# EAGLE design Adafruit_PCF8591 (EAGLE 9.6.2)
COMPANY: ADAFRUIT INDUSTRIES; DRAWN: KTOWN; REV: A
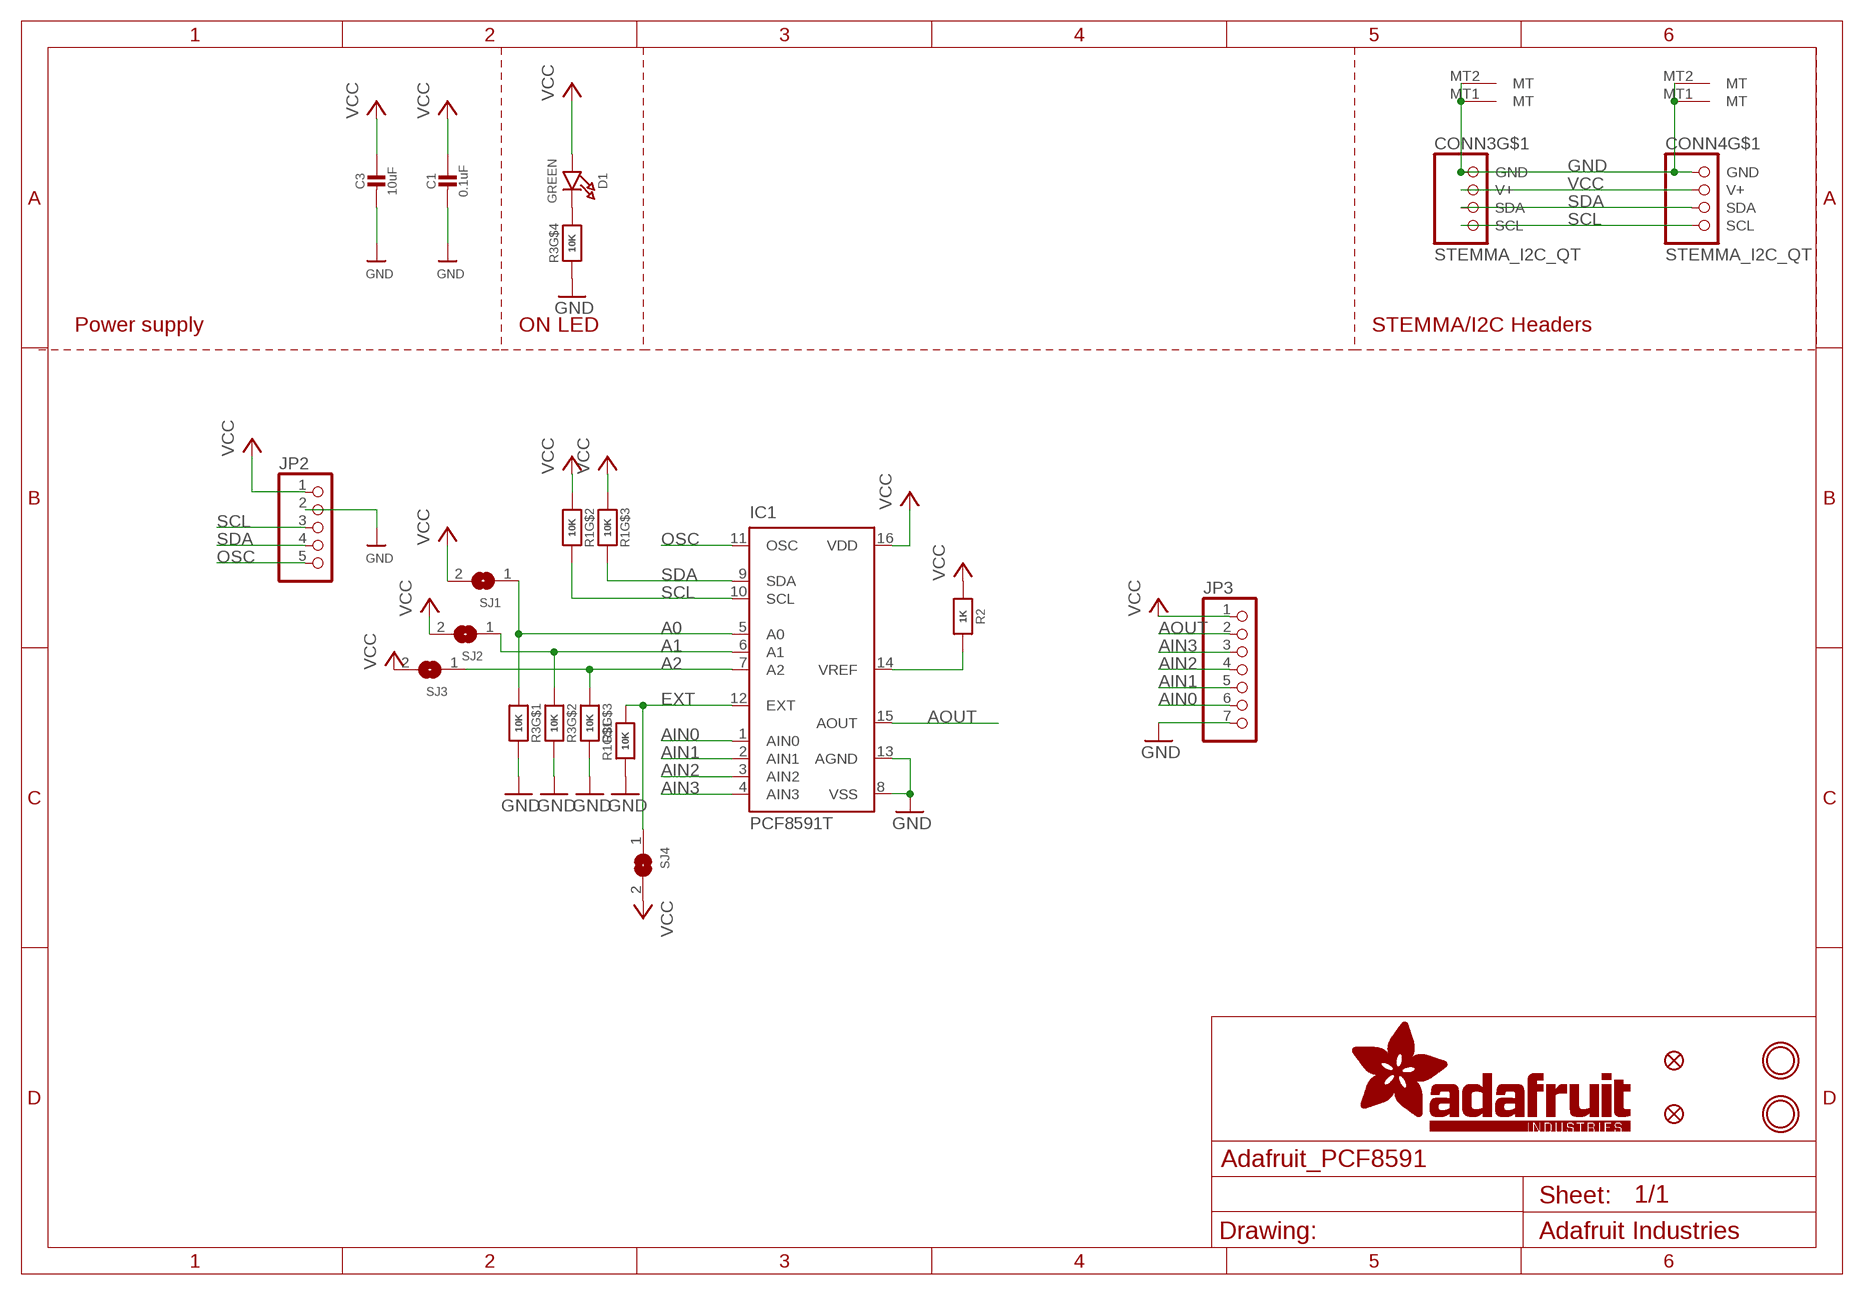
[diagram p0: schematic, sheet 1]

## Parts
C1  0.1uF  CAP_CERAMIC0603_NO  [0603-NO]
C3  10uF  CAP_CERAMIC0805-NOOUTLINE  [0805-NO]
CONN3  STEMMA_I2C_QT  [JST_SH4]
CONN4  STEMMA_I2C_QT  [JST_SH4]
D1  GREEN  LED0603_NOOUTLINE  [CHIPLED_0603_NOOUTLINE]
FID3  FIDUCIAL_1MM  [FIDUCIAL_1MM]
FID4  FIDUCIAL_1MM  [FIDUCIAL_1MM]
IC1  PCF8591T  [SO16W]
JP2  HEADER-1X570MIL  [1X05_ROUND_70]
JP3  HEADER-1X770MIL  [1X07_ROUND_70]
R1  10K  RESISTOR_4PACK  [RESPACK_4X0603]
R2  1K  RESISTOR_0603_NOOUT  [0603-NO]
R3  10K  RESISTOR_4PACK  [RESPACK_4X0603]
SJ1  SOLDERJUMPER  [SOLDERJUMPER_ARROW_NOPASTE]
SJ2  SOLDERJUMPER  [SOLDERJUMPER_ARROW_NOPASTE]
SJ3  SOLDERJUMPER  [SOLDERJUMPER_ARROW_NOPASTE]
SJ4  SOLDERJUMPER  [SOLDERJUMPER_ARROW_NOPASTE]
U$19  MOUNTINGHOLE2.5  [MOUNTINGHOLE_2.5_PLATED]
U$21  MOUNTINGHOLE2.5  [MOUNTINGHOLE_2.5_PLATED]

## Nets
A0: IC1.5(A0) R3.1 SJ1.1
A1: IC1.6(A1) R3.2 SJ2.1
A2: IC1.7(A2) R3.3 SJ3.1
AIN0: IC1.1(AIN0) JP3.6
AIN1: IC1.2(AIN1) JP3.5
AIN2: IC1.3(AIN2) JP3.4
AIN3: IC1.4(AIN3) JP3.3
AOUT: IC1.15(AOUT) JP3.2
EXT: IC1.12(EXT) R1.8 SJ4.1
GND [highpower]: C1.2 C3.2 CONN3.1(GND) CONN3.MT1(MT) CONN3.MT2(MT) CONN4.1(GND) CONN4.MT1(MT) CONN4.MT2(MT) IC1.8(VSS) IC1.13(AGND) JP2.2 JP3.7 R1.1 R3.4 R3.6 R3.7 R3.8
N$1: D1.C R3.5
N$4: IC1.14(VREF) R2.2
OSC: IC1.11(OSC) JP2.5
SCL: CONN3.4(SCL) CONN4.4(SCL) IC1.10(SCL) JP2.3 R1.7
SDA: CONN3.3(SDA) CONN4.3(SDA) IC1.9(SDA) JP2.4 R1.6
VCC [highpower]: C1.1 C3.1 CONN3.2(V+) CONN4.2(V+) D1.A IC1.16(VDD) JP2.1 JP3.1 R1.2 R1.3 R2.1 SJ1.2 SJ2.2 SJ3.2 SJ4.2
Unconnected: R1.4 R1.5

## Notes on the sheet
- Power supply | ON LED | STEMMA/I2C Headers

## Library data of the parts
C1 C3 = microbuilder:CAP_CERAMIC: Ceramic Capacitors For new designs, use the packages preceded by an '_' character since they are more reliable: The following footprints should be used on most boards: _0402 - Standard footprint for regular board layouts _0603 - Standard footprint for regular board layouts _0805 - Standard footprint for regular board layouts _1206 - Standard footprint for regular board layouts For extremely tight-pitch boards where space is at a premium, the following 'micro-pitch' footprints can be used (smaller pads, no silkscreen outline, etc.): _0402MP - Micro-pitch footprint for very dense/compact boards _0603MP - Micro-pitch footprint for very dense/compact boards _0805MP - Micro-pitch footprint for very dense/compact boards _1206MP - Micro-pitch footprint for very dense/compact boards
CONN3 CONN4 = microbuilder:STEMMA_I2C
D1 = microbuilder:LED: LED 0603 - 0603 Surface Mount Package 2mA: Green LED - Low Power (3.9mcd, 2ma, 1.7Vf) - Digikey: 475-2709-2-ND Orange LED - Low Power (9.8mcd, 2ma, 1.8Vf) - Digikey: 475-1194-2-ND Red LED - Low Power (5mcd, 2ma, 1.8Vf) - Digikey: 475-1195-2-ND Yellow LED - Low Power (7mcd, 2ma, 1.8Vf) - Digikey: 475-1196-2-ND 5mA: Blue LED - Low Power (17mcd, 5ma, 2.9Vf) - Digikey: LNJ937W8CRACT-ND 0805 - 0805 Surface Mount Package 2mA: Red LED (8.8mcd, 2mA, 1.8Vf, Clear) - Low Power [Digikey: 475-2510-1-ND] Green LED (5mcd, 2mA, 1.8Vf, Clear) - Low Power [Digikey: 475-2730-1-ND] Yellow LED (11.3mcd, 2mA, 1.8Vf, Clear) - Low Power [Digikey: 475-2555-1-ND] 20mA: Red LED (104mcd, 20mA, Diffused) - LS R976 [Digikey: 475-1278-6-ND] Red LED (12mcd, 20mA, 2.0Vf, Clear) - APT2012EC [Digikey: 754-1128-1-ND] Green LED (15mcd, 20mA, 2.2Vf, Clear) - APT2012GC [Digikey: 754-1131-1-ND] Orange LED (160mcd, 20mA, 2.1Vf, Clear) - APT2012SECK [Digikey: 754-1130-1-ND] 1206 - 1206 Surface Mount Package Green LED (26mcd, 20mA, Diffused) - LG N971 [Digikey: 475-1407-6-ND] Red LED (15mcd, 20mA, Diffused) - LH N974 [Digikey: 475-1416-6-ND] Cree - Cree High-Power Surface Mount LEDs XPEBWT-L1-0000-00D50 - White 111lm 350mA 2.9Vf 6200K 110° XTEAWT-00-0000-00000LEE3 - White 114lm 350mA 2.85Vf 5000K 115° Everlight - Everlight 45-21 Series Surface Mount LEDs 45-21/QK2C-B2832AC2CB2/2T - Warm White 2000mcd 20mA 3.25Vf 3050K 120° 45-21/LK2C-B38452C4CB2/2T - Nuetral White 2000mcd 20mA 3.25Vf 4150K 120° 45-21/LK2C-B50634C6CB2/2T - Cold White 2200mcd 20mA 3.25Vf 5650K 120° PLCC2 Reverse Mount LS T77K-J1L2-1-0-2-R18-Z - Red 11.25mcd 2mA 1.8Vf 630nm 120° LO T77K-L1M2-24-Z - Orange 19.6mcd 2mA 1.8Vf 606nm 120° LY T77K-K2M1-26-Z - Yellow 15.7mcd 2mA 1.8Vf 587nm 120°
FID3 FID4 = microbuilder:FIDUCIAL: Fiducial Alignment Points Various fiducial points for machine vision alignment.; BOM: EXCLUDE
IC1 = micro-philips:PCF8591: I2C-Bus D/A CONVERTER; MPN: PCF8591T/2,512; OC_FARNELL: 1826767; OC_NEWARK: 70R6911
JP2 = microbuilder:HEADER-1X5: PIN HEADER
JP3 = microbuilder:HEADER-1X7: PIN HEADER
R1 R3 = microbuilder:RESISTOR_4PACK: Resistor Packs (4 resistors) 4 x 0603 10K 1/16W - Digikey: YC164J-10KCT-ND
R2 = microbuilder:RESISTOR: Resistors For new designs, use the packages preceded by an '_' character since they are more reliable: The following footprints should be used on most boards: _0402 - Standard footprint for regular board layouts _0603 - Standard footprint for regular board layouts _0805 - Standard footprint for regular board layouts _1206 - Standard footprint for regular board layouts For extremely tight-pitch boards where space is at a premium, the following 'micro-pitch' footprints can be used (smaller pads, no silkscreen outline, etc.): _0402MP - Micro-pitch footprint for very dense/compact boards _0603MP - Micro-pitch footprint for very dense/compact boards _0805MP - Micro-pitch footprint for very dense/compact boards _1206MP - Micro-pitch footprint for very dense/compact boards
SJ1-SJ4 = microbuilder:SOLDERJUMPER: SMD Solder JUMPER Solder the two pads together to create a connection, or remove the solder to break it. REFLOW - Use this footprint for solder paste and reflow ovens. WAVE - Use this footprint for hand-soldering (larger pads). CLOSED - Has a trace between the two pads to ensure it is closed by default. The trace needs to be cut to disable the jumper, and can be closed again by creating a solder bridge between the two pads.; BOM: EXCLUDE
U$19 U$21 = microbuilder:MOUNTINGHOLE: Mounting Hole For #2 screws (0.086"/2.18mm width, 0.094"/2.4mm hole) use 2.5mm; BOM: EXCLUDE

## Net classes
1 highpower: width 0.305 mm, drill 0.483 mm
2 lowpower: width 0.254 mm, drill 0.483 mm

## Board
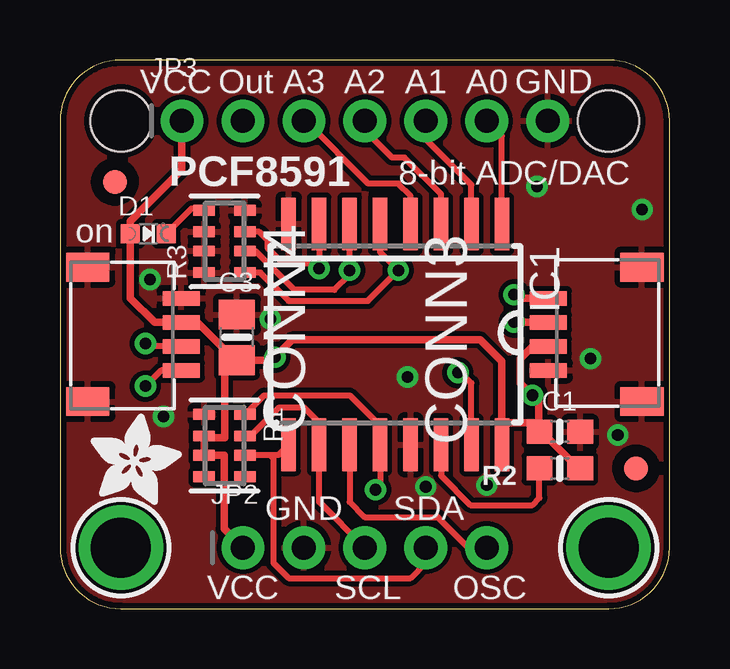
[diagram p1: board, top side]
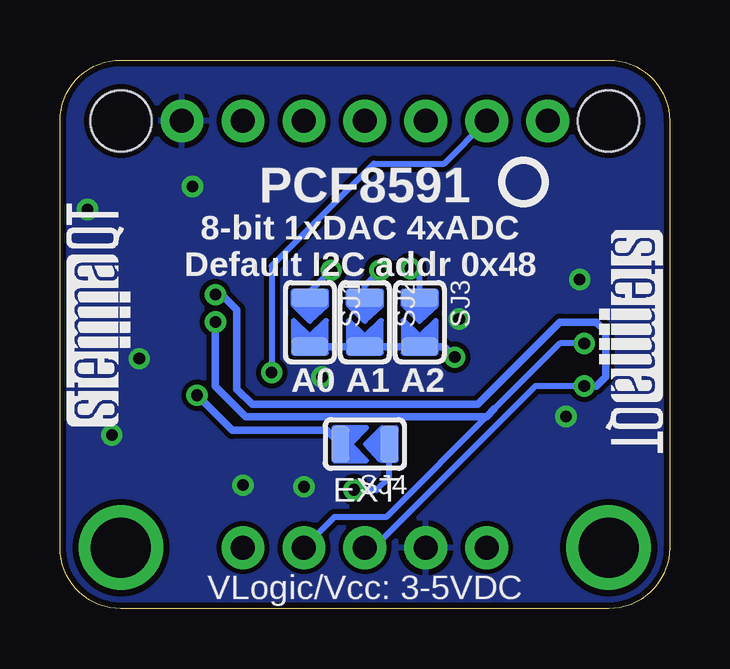
[diagram p2: board, bottom side, seen from below]

Size 25.4 x 22.86 mm. Coordinates in mm from the lower left corner, seen from the top.
Outline: 0,20.32 0,2.54 arc90 2.54,0 22.86,0 arc90 25.4,2.54 25.4,20.32 arc90 22.86,22.86 2.54,22.86 arc90 0,20.32
Copper layers (1*16): Top 0.035mm / dielectric 1.5mm / Bottom 0.035mm
Design rules "adafruit *": minimum track width 8mil, minimum drill 15.5mil, track to track 8mil, track to pad 8mil, pad to pad 8mil, via to via 8mil, smd to smd 8mil, copper to edge 10mil, drill to drill 8mil, minimum pad ring 10mil, minimum via ring 8mil, stop-mask expansion 2mil, vias tented up to drill 20mil, thermal gap 10mil
Holes 2.54 mm at 2.54,20.32 22.86,20.32

### Footprints (pad centres in the part's own frame; a part is rotated, then mirrored left to right if it is on the bottom)
0603-NO = smd 1.075 x 1: 1 -0.85,0; 2 0.85,0
0805-NO = smd 1.24 x 1.5: 1 -0.95,0; 2 0.95,0
JST_SH4 = smd 0.6 x 1.55: 1 -1.5,2.514; 2 -0.5,2.514; 3 0.5,2.514; 4 1.5,2.514 | smd 1.2 x 1.8: MT1 -2.8,-1.386; MT2 2.8,-1.386
CHIPLED_0603_NOOUTLINE = smd 0.8 x 0.8: A 0,-0.75; C 0,0.75
FIDUCIAL_1MM = smd 1 x 1: 1 0,0
SO16W = smd 0.6 x 2.2: 1 -4.445,-4.6; 2 -3.175,-4.6; 3 -1.905,-4.6; 4 -0.635,-4.6; 5 0.635,-4.6; 6 1.905,-4.6; 7 3.175,-4.6; 8 4.445,-4.6; 9 4.445,4.6; 10 3.175,4.6; 11 1.905,4.6; 12 0.635,4.6; 13 -0.635,4.6; 14 -1.905,4.6; 15 -3.175,4.6; 16 -4.445,4.6
1X05_ROUND_70 = drill 1 pad 1.778: 1 -5.08,0; 2 -2.54,0; 3 0,0; 4 2.54,0; 5 5.08,0
1X07_ROUND_70 = drill 1 pad 1.778: 1 -7.62,0; 2 -5.08,0; 3 -2.54,0; 4 0,0; 5 2.54,0; 6 5.08,0; 7 7.62,0
RESPACK_4X0603 = smd 0.45 x 0.9: 1 -1.3,-0.85; 2 -0.4,-0.85; 3 0.4,-0.85; 4 1.3,-0.85; 5 1.3,0.85; 6 0.4,0.85; 7 -0.4,0.85; 8 -1.3,0.85
SOLDERJUMPER_ARROW_NOPASTE = smd 0.762 x 1.524: 1 -1.016,0; 2 1.016,0
MOUNTINGHOLE_2.5_PLATED = drill 2.5 pad 3.2: P$1 0,0

### Placement (x,y rotation side)
C1  20.83,7.37 0 top
C3  7.37,11.3 90 top
CONN3  22.86,11.43 90 top
CONN4  2.54,11.43 270 top
D1  3.68,15.62 270 top
FID3  2.29,17.78 0 top
FID4  24,5.84 0 top
IC1  13.97,11.43 180 top
JP2  12.7,2.54 0 top
JP3  12.7,20.32 0 top
R1  6.86,6.79 270 top
R2  20.83,5.84 180 top
R3  6.86,15.3 90 top
SJ1  14.99,11.94 270 bottom
SJ2  12.7,11.94 270 bottom
SJ3  10.41,11.94 270 bottom
SJ4  12.7,6.86 180 bottom
U$19  2.54,2.54 0 top
U$21  22.86,2.54 0 top
U$22  [ADAFRUIT_3.5MM]  1.27,4.32 0 top
U$25  [PCBFEAT-REV-040]  6.1,17.78 0 bottom
U$30  [STEMMAQT]  22.48,7.62 90 bottom
U$31  [STEMMAQT]  2.92,15.75 270 bottom

### Tracks (layer width: path | path; a pad name or v marks a point on that pad's centre or on a via)
A0  (via drill 0.48)
  Top 0.254: R3.1 8.35,14 9.53,12.83 12.83,12.83 v14.1,14.1 13.34,14.86 IC1.5
  Bottom 0.254: SJ1.1 14.99,13.21 v14.1,14.1
A1  (via drill 0.48)
  Top 0.254: IC1.6 v12.06,14.1 12.06,13.92 11.43,13.28 9.76,13.28 8.14,14.9 R3.2
  Bottom 0.254: SJ2.1 12.7,13.46 v12.06,14.1
A2  (via drill 0.48)
  Top 0.254: IC1.7 v10.79,14.18 10.59,14.38 9.31,14.38 8.64,15.05 8.64,15.36 8.3,15.7 R3.3
  Bottom 0.254: SJ3.1 10.41,13.79 v10.79,14.18
AIN0
  Top 0.254: IC1.1 18.41,19.68 JP3.6
AIN1
  Top 0.254: IC1.2 17.14,17.65 15.24,19.56 JP3.5
AIN2
  Top 0.254: IC1.3 15.88,17.27 14.35,18.8 13.84,18.8 12.7,19.94 JP3.4
AIN3
  Top 0.254: IC1.4 14.61,17.2 14.1,17.7 12.85,17.7 10.23,20.32 JP3.3
AOUT  (via drill 0.48)
  Top 0.254: IC1.15 17.14,9.4 16.71,9.84 v16.58,9.84
  Bottom 0.254: JP3.2 9.4,18.54 12.32,18.54 16.58,14.28 v16.58,9.84
EXT  (via drill 0.48)
  Top 0.254: R1.8 8.51,8.89 12.06,8.89 13.34,7.62 IC1.12 13.34,5.14 v13.14,4.95
  Bottom 0.254: v13.14,4.95 12.19,4.95 11.68,5.46 SJ4.1
GND  (via drill 0.48)
  other vias: 14.48,9.65 23.24,7.24 3.75,13.72 8.76,12.06 19.88,17.59 4.32,8 15.24,5.08 17.78,5.14 22.1,10.41 24.26,16.64
  pour Top: 0,22.86 25.4,22.86 25.4,0 0,0
  pour Bottom: 0,22.86 25.4,22.86 25.4,0 0,0
N$1
  Top 0.254: D1.C 5.48,16.67 5.94,16.67 R3.5
N$4
  Top 0.254: IC1.14 15.88,5.55 17.1,4.32 19.68,4.32 19.98,4.61 R2.2
OSC
  Top 0.254: IC1.11 12.06,4.45 12.7,3.81 15.75,3.81 17.02,2.54 JP2.5
SCL  (via drill 0.48)
  Top 0.254: CONN4.4 4.21,9.93 v3.56,9.27 | R1.7 7.96,7.19 9.14,8.38 10.16,8.38 10.79,7.75 IC1.10 10.79,4.45 JP2.3
  Top 0.305: CONN3.4 19.07,12.93 v18.92,13.08
  Bottom 0.254: JP2.3 12.32,2.54 5.59,9.27 v3.56,9.27
  Bottom 0.305: v18.92,13.08 18.67,13.08 18.03,12.45 18.03,9.14 17.4,8.51 8,8.51 4.57,11.94 3.05,11.94 2.67,11.56 2.67,9.65 3.05,9.27 v3.56,9.27
SDA  (via drill 0.48)
  Top 0.254: CONN4.3 3.67,10.93 v3.56,11.05 | IC1.9 9.09,6.39 8.76,6.39 | 8.76,6.39 R1.6 | 8.76,6.39 8.89,6.27 8.89,1.91 9.53,1.27 14.61,1.27 15.24,1.91 JP2.4
  Top 0.305: CONN3.3 18.93,11.93 v18.92,11.94
  Bottom 0.254: v3.56,11.05 4.57,11.05 7.3,8.32 11.81,3.81 13.97,3.81 JP2.4
  Bottom 0.305: 7.3,8.32 7.62,8 17.65,8 18.92,9.27 v18.92,11.94
VCC  (via drill 0.48)
  Top 0.305: R2.1 21.59,5.84 20.07,7.37 C1.1 19.94,7.37 19.94,7.75 | IC1.16 18.41,7.87 | 18.41,7.87 18.41,10.3 17.52,11.2 9.67,11.2 v8.95,10.48 | 7.11,10.54 5.72,11.93 CONN4.2 3.94,11.93 2.93,12.94 D1.A 2.93,16.14 5.08,18.29 JP3.1 | 7.11,10.54 7.3,10.35 C3.1 8.82,10.35 v8.95,10.48 | 7.11,10.54 6.86,10.29 6.86,7.11 6.09,7.11 R1.2 R1.3 6.84,6.39 6.84,3.32 JP2.1 | v8.95,10.48 | 19.94,7.75 18.54,7.75 18.41,7.87 | 19.94,7.75 19.94,8.64 v19.68,8.89 19.18,9.4 19.18,10.41 19.69,10.93 CONN3.2
  Bottom 0.305: SJ1.2 SJ2.2 SJ3.2 9.4,10.92 v8.95,10.48 | SJ4.2 14.29,7.43 18.22,7.43 v19.68,8.89

### Text on the board
tPlace: VCC | Out | A3 | A2 | A1 | A0 | GND | PCF8591 | 8-bit ADC/DAC | on | GND | SDA | VCC | SCL | OSC
bPlace: PCF8591 | 8-bit 1xDAC 4xADC / Default I2C addr 0x48 | A2 | A1 | A0 | EXT | VLogic/Vcc: 3-5VDC